# Altium project MultimediaEthernet.PrjPcb
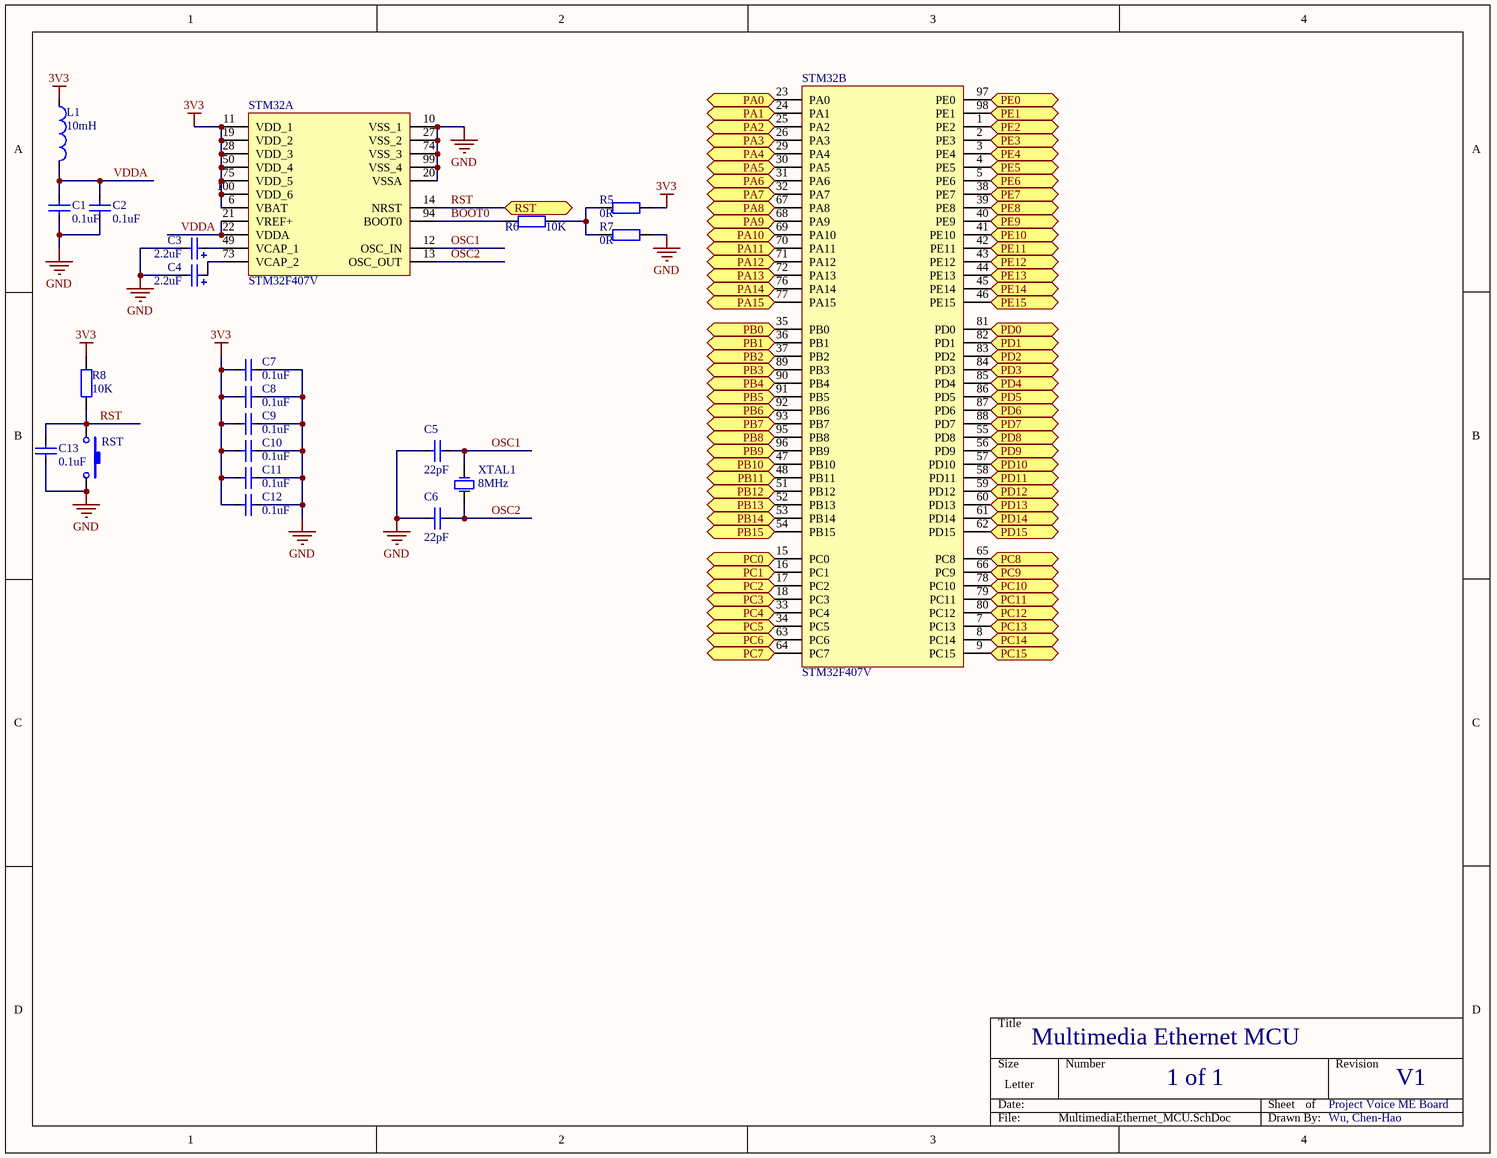
[diagram p0: MultimediaEthernet_MCU.SchDoc]
6 sheets, 21 parts. Net scope: flat (ports and power ports of the same name join across sheets).
Sheets:
  MultimediaEthernet_MCU.SchDoc
  MultimediaEthernet_SD.SchDoc
  MultimediaEthernet_LED.SchDoc
  MultimediaEthernet_BUTTON.SchDoc
  MultimediaEthernet_USB.SchDoc
  MultimediaEthernet_SWD.SchDoc

## Sheet MultimediaEthernet_MCU.SchDoc
size Letter

### Parts
C1  value 0.1uF  [CAP_0603]  (hidden comment: Cap_0603)
C2  value 0.1uF  [CAP_0603]  (hidden comment: Cap_0603)
C3  value 2.2uF  [CAP_TAN_P0805]  (hidden comment: Cap_Tan_0805)
C4  value 2.2uF  [CAP_TAN_P0805]  (hidden comment: Cap_Tan_0805)
C5  value 22pF  [CAP_0603]  (hidden comment: Cap_0603)
C6  value 22pF  [CAP_0603]  (hidden comment: Cap_0603)
C7  value 0.1uF  [CAP_0603]  (hidden comment: Cap_0603)
C8  value 0.1uF  [CAP_0603]  (hidden comment: Cap_0603)
C9  value 0.1uF  [CAP_0603]  (hidden comment: Cap_0603)
C10  value 0.1uF  [CAP_0603]  (hidden comment: Cap_0603)
C11  value 0.1uF  [CAP_0603]  (hidden comment: Cap_0603)
C12  value 0.1uF  [CAP_0603]  (hidden comment: Cap_0603)
C13  value 0.1uF  [CAP_0603]  (hidden comment: Cap_0603)
L1  value 10mH  [IND_0603]  (hidden comment: Ind_0603)
R5  value 0R  [RES_0603]  (hidden comment: Res_0603)
R6  value 10K  [RES_0603]  (hidden comment: Res_0603)
R7  value 0R  [RES_0603]  (hidden comment: Res_0603)
R8  value 10K  [RES_0603]  (hidden comment: Res_0603)
RST  SW-PB_1  [BT_90_T]  (value not drawn)
STM32  STM32F407V  [STM32F_100]  (parts A,B of 2)
XTAL1  value 8MHz  [XTAL_5032]  (hidden comment: XTAL_5032)

### Ports
PA0, PA1, PA2, PA3, PA4, PA5, PA6, PA7, PA8, PA9, PA10, PA11, PA12, PA13, PA14, PA15, PB0, PB1, PB2, PB3, PB4, PB5, PB6, PB7, PB8, PB9, PB10, PB11, PB12, PB13, PB14, PB15, PC0, PC1, PC2, PC3, PC4, PC5, PC6, PC7, PC8, PC9, PC10, PC11, PC12, PC13, PC14, PC15, PD0, PD1, PD2, PD3, PD4, PD5, PD6, PD7, PD8, PD9, PD10, PD11, PD12, PD13, PD14, PD15, PE0, PE1, PE2, PE3, PE4, PE5, PE6, PE7, PE8, PE9, PE10, PE11, PE12, PE13, PE14, PE15, RST

### Nets
3V3: C7.2 C8.2 C9.2 C10.2 C11.2 C12.2 L1.1 R5.2 R8.1 STM32.6(VBAT) STM32.11(VDD_1) STM32.19(VDD_2) STM32.28(VDD_3) STM32.50(VDD_4) STM32.75(VDD_5) STM32.100(VDD_6)
GND: C1.2 C2.2 C3.2 C4.2 C5.1 C6.1 C7.1 C8.1 C9.1 C10.1 C11.1 C12.1 C13.2 R7.2 RST.2 STM32.10(VSS_1) STM32.20(VSSA) STM32.27(VSS_2) STM32.74(VSS_3) STM32.99(VSS_4)
BOOT0: R6.1 STM32.94(BOOT0)
OSC1: C5.2 STM32.12(OSC_IN) XTAL1.2(OSC2)
OSC2: C6.2 STM32.13(OSC_OUT) XTAL1.1(OSC1)
RST: C13.1 R8.2 RST.1 STM32.14(NRST) ; port RST
VDDA: C1.1 C2.1 L1.2 STM32.21(VREF+) STM32.22(VDDA)
NetC3_1: C3.1 STM32.49(VCAP_1)
NetC4_1: C4.1 STM32.73(VCAP_2)
NetR5_1: R5.1 R6.2 R7.1
NetSTM32_1: STM32.1(PE2) ; port PE2
NetSTM32_2: STM32.2(PE3) ; port PE3
NetSTM32_3: STM32.3(PE4) ; port PE4
NetSTM32_4: STM32.4(PE5) ; port PE5
NetSTM32_5: STM32.5(PE6) ; port PE6
NetSTM32_7: STM32.7(PC13) ; port PC13
NetSTM32_8: STM32.8(PC14) ; port PC14
NetSTM32_9: STM32.9(PC15) ; port PC15
NetSTM32_15: STM32.15(PC0) ; port PC0
NetSTM32_16: STM32.16(PC1) ; port PC1
NetSTM32_17: STM32.17(PC2) ; port PC2
NetSTM32_18: STM32.18(PC3) ; port PC3
NetSTM32_23: STM32.23(PA0) ; port PA0
NetSTM32_24: STM32.24(PA1) ; port PA1
NetSTM32_25: STM32.25(PA2) ; port PA2
NetSTM32_26: STM32.26(PA3) ; port PA3
NetSTM32_29: STM32.29(PA4) ; port PA4
NetSTM32_30: STM32.30(PA5) ; port PA5
NetSTM32_31: STM32.31(PA6) ; port PA6
NetSTM32_32: STM32.32(PA7) ; port PA7
NetSTM32_33: STM32.33(PC4) ; port PC4
NetSTM32_34: STM32.34(PC5) ; port PC5
NetSTM32_35: STM32.35(PB0) ; port PB0
NetSTM32_36: STM32.36(PB1) ; port PB1
NetSTM32_37: STM32.37(PB2) ; port PB2
NetSTM32_38: STM32.38(PE7) ; port PE7
NetSTM32_39: STM32.39(PE8) ; port PE8
NetSTM32_40: STM32.40(PE9) ; port PE9
NetSTM32_41: STM32.41(PE10) ; port PE10
NetSTM32_42: STM32.42(PE11) ; port PE11
NetSTM32_43: STM32.43(PE12) ; port PE12
NetSTM32_44: STM32.44(PE13) ; port PE13
NetSTM32_45: STM32.45(PE14) ; port PE14
NetSTM32_46: STM32.46(PE15) ; port PE15
NetSTM32_47: STM32.47(PB10) ; port PB10
NetSTM32_48: STM32.48(PB11) ; port PB11
NetSTM32_51: STM32.51(PB12) ; port PB12
NetSTM32_52: STM32.52(PB13) ; port PB13
NetSTM32_53: STM32.53(PB14) ; port PB14
NetSTM32_54: STM32.54(PB15) ; port PB15
NetSTM32_55: STM32.55(PD8) ; port PD8
NetSTM32_56: STM32.56(PD9) ; port PD9
NetSTM32_57: STM32.57(PD10) ; port PD10
NetSTM32_58: STM32.58(PD11) ; port PD11
NetSTM32_59: STM32.59(PD12) ; port PD12
NetSTM32_60: STM32.60(PD13) ; port PD13
NetSTM32_61: STM32.61(PD14) ; port PD14
NetSTM32_62: STM32.62(PD15) ; port PD15
NetSTM32_63: STM32.63(PC6) ; port PC6
NetSTM32_64: STM32.64(PC7) ; port PC7
NetSTM32_65: STM32.65(PC8) ; port PC8
NetSTM32_66: STM32.66(PC9) ; port PC9
NetSTM32_67: STM32.67(PA8) ; port PA8
NetSTM32_68: STM32.68(PA9) ; port PA9
NetSTM32_69: STM32.69(PA10) ; port PA10
NetSTM32_70: STM32.70(PA11) ; port PA11
NetSTM32_71: STM32.71(PA12) ; port PA12
NetSTM32_72: STM32.72(PA13) ; port PA13
NetSTM32_76: STM32.76(PA14) ; port PA14
NetSTM32_77: STM32.77(PA15) ; port PA15
NetSTM32_78: STM32.78(PC10) ; port PC10
NetSTM32_79: STM32.79(PC11) ; port PC11
NetSTM32_80: STM32.80(PC12) ; port PC12
NetSTM32_81: STM32.81(PD0) ; port PD0
NetSTM32_82: STM32.82(PD1) ; port PD1
NetSTM32_83: STM32.83(PD2) ; port PD2
NetSTM32_84: STM32.84(PD3) ; port PD3
NetSTM32_85: STM32.85(PD4) ; port PD4
NetSTM32_86: STM32.86(PD5) ; port PD5
NetSTM32_87: STM32.87(PD6) ; port PD6
NetSTM32_88: STM32.88(PD7) ; port PD7
NetSTM32_89: STM32.89(PB3) ; port PB3
NetSTM32_90: STM32.90(PB4) ; port PB4
NetSTM32_91: STM32.91(PB5) ; port PB5
NetSTM32_92: STM32.92(PB6) ; port PB6
NetSTM32_93: STM32.93(PB7) ; port PB7
NetSTM32_95: STM32.95(PB8) ; port PB8
NetSTM32_96: STM32.96(PB9) ; port PB9
NetSTM32_97: STM32.97(PE0) ; port PE0
NetSTM32_98: STM32.98(PE1) ; port PE1

### Notes on the sheet
- Multimedia Ethernet MCU
- 1 of 1
- Project Voice ME Board
- V1
- Wu, Chen-Hao

### Library data of the parts
C1 C2 C5-C13 = Cap_0603: Capacitor
C3 C4 = Cap_Tan_0805: Capacitor
L1 = Ind_0603: Inductor
R5-R8 = Res_0603: Resistor
RST = SW-PB_1: Switch; Published: 24-Mar-1999; LatestRevisionDate: 17-Jul-2002; LatestRevisionNote: Re-released for DXP Platform.; PackageReference: SPST-2; Publisher: Altium Limited; PackageDescription: Switch; 2 Leads
STM32 = STM32F407V: MCU
XTAL1 = XTAL_5032: Crystal Oscillator; Published: 8-Jun-2000; LatestRevisionDate: 17-Jul-2002; LatestRevisionNote: Re-released for DXP Platform.; PackageReference: R38; Publisher: Altium Limited; PackageDescription: Crystal, Thru-Hole; 2 Leads; Body 3.1 x 8.2 mm (Dia.xH)

## Sheet MultimediaEthernet_SD.SchDoc
size Letter
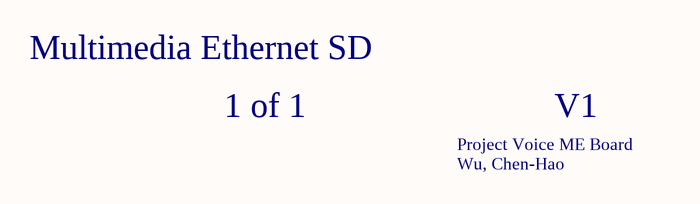
[diagram p1: MultimediaEthernet_SD.SchDoc]

### Notes on the sheet
- Multimedia Ethernet SD
- 1 of 1
- Project Voice ME Board
- V1
- Wu, Chen-Hao

## Sheet MultimediaEthernet_LED.SchDoc
size Letter
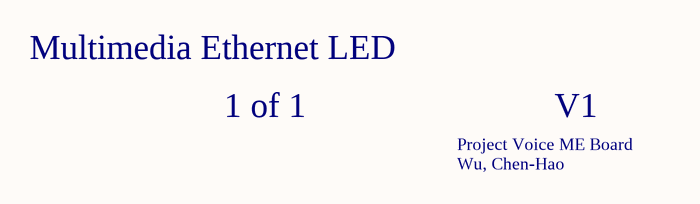
[diagram p2: MultimediaEthernet_LED.SchDoc]

### Notes on the sheet
- Multimedia Ethernet LED
- 1 of 1
- Project Voice ME Board
- V1
- Wu, Chen-Hao

## Sheet MultimediaEthernet_BUTTON.SchDoc
size Letter
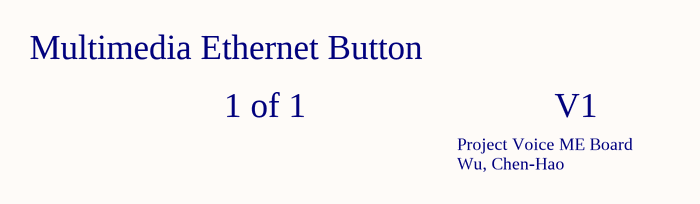
[diagram p3: MultimediaEthernet_BUTTON.SchDoc]

### Notes on the sheet
- Multimedia Ethernet Button
- 1 of 1
- Project Voice ME Board
- V1
- Wu, Chen-Hao

## Sheet MultimediaEthernet_USB.SchDoc
size Letter
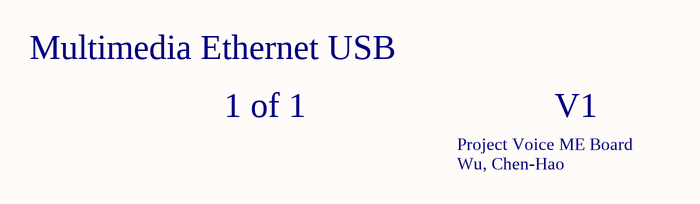
[diagram p4: MultimediaEthernet_USB.SchDoc]

### Notes on the sheet
- Multimedia Ethernet USB
- 1 of 1
- Project Voice ME Board
- V1
- Wu, Chen-Hao

## Sheet MultimediaEthernet_SWD.SchDoc
size Letter
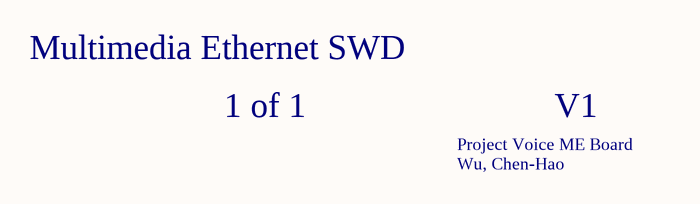
[diagram p5: MultimediaEthernet_SWD.SchDoc]

### Notes on the sheet
- Multimedia Ethernet SWD
- 1 of 1
- Project Voice ME Board
- V1
- Wu, Chen-Hao